# EAGLE schematic F20_NoMCU_PDM_V1 (EAGLE 9.5.2)
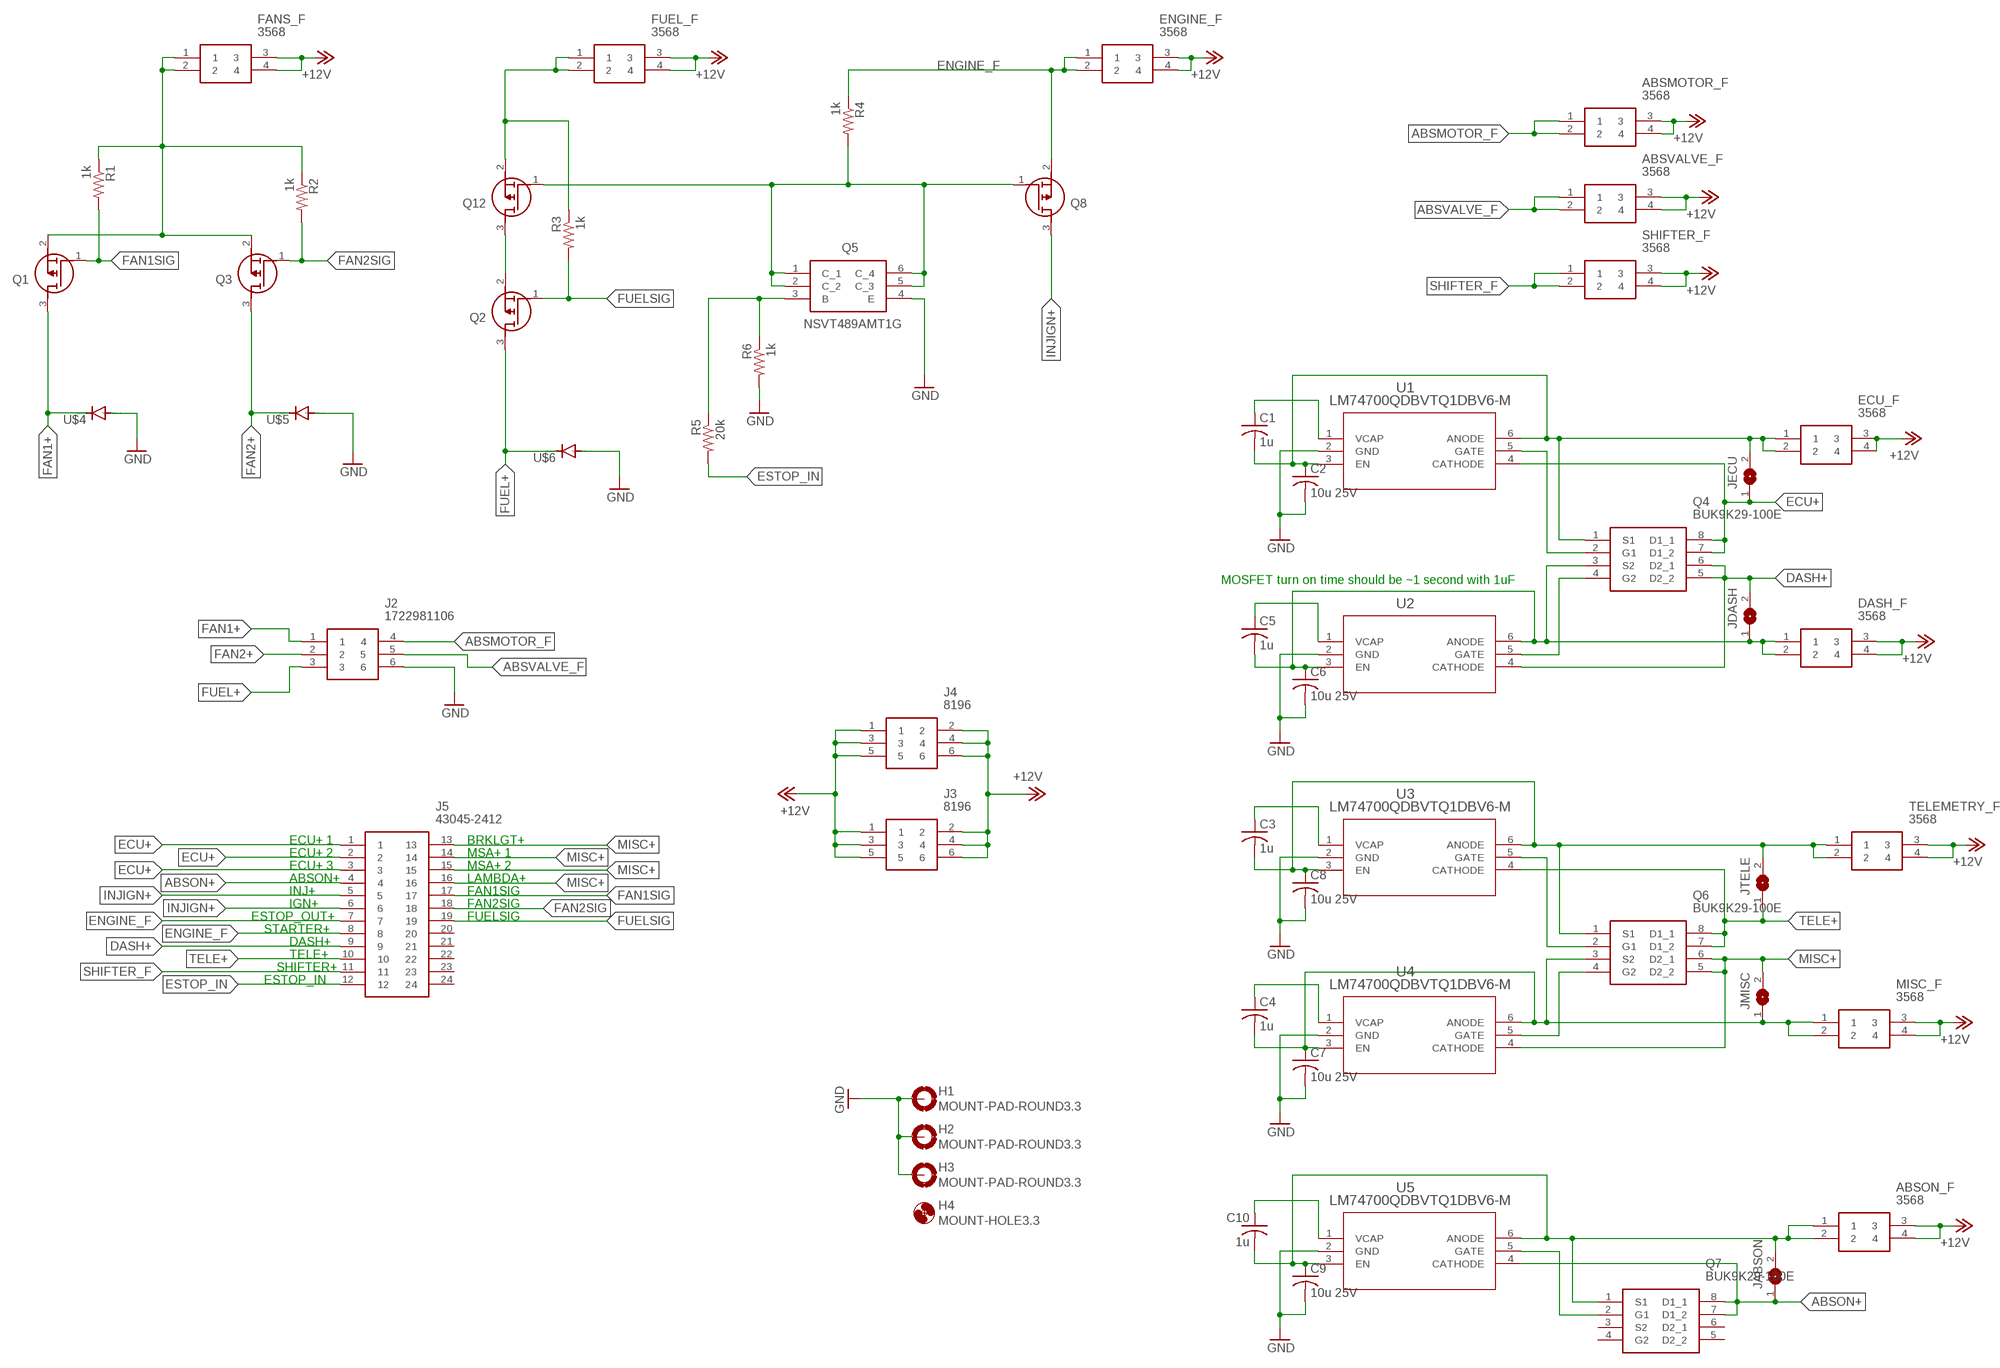
[diagram p0: schematic, sheet 1]

## Parts
ABSMOTOR_F  3568  [3568]
ABSON_F  3568  [3568]
ABSVALVE_F  3568  [3568]
C1  1u  C-USC0805  [C0805]
C2  10u 25V  C-USC0805  [C0805]
C3  1u  C-USC0805  [C0805]
C4  1u  C-USC0805  [C0805]
C5  1u  C-USC0805  [C0805]
C6  10u 25V  C-USC0805  [C0805]
C7  10u 25V  C-USC0805  [C0805]
C8  10u 25V  C-USC0805  [C0805]
C9  10u 25V  C-USC0805  [C0805]
C10  1u  C-USC0805  [C0805]
DASH_F  3568  [3568]
ECU_F  3568  [3568]
ENGINE_F  3568  [3568]
FANS_F  3568  [3568]
FUEL_F  3568  [3568]
H1  MOUNT-PAD-ROUND3.3  [3,3-PAD]
H2  MOUNT-PAD-ROUND3.3  [3,3-PAD]
H3  MOUNT-PAD-ROUND3.3  [3,3-PAD]
H4  MOUNT-HOLE3.3  [3,3]
J2  1722981106  [1722981106]
J3  8196  [8196]
J4  8196  [8196]
J5  43045-2412  [43045-2412]
JABSON  SJ  [SJ]
JDASH  SJ  [SJ]
JECU  SJ  [SJ]
JMISC  SJ  [SJ]
JTELE  SJ  [SJ]
MISC_F  3568  [3568]
Q1  IPB120P04P4L03ATMA1  [PG-TO263-3-2_1]
Q2  IPB120P04P4L03ATMA1  [PG-TO263-3-2_1]
Q3  IPB120P04P4L03ATMA1  [PG-TO263-3-2_1]
Q4  BUK9K29-100E  [SOIC127P605X105-8N]
Q5  NSVT489AMT1G  [SOT95P275X110-6N]
Q6  BUK9K29-100E  [SOIC127P605X105-8N]
Q7  BUK9K29-100E  [SOIC127P605X105-8N]
Q8  IPB120P04P4L03ATMA1  [PG-TO263-3-2_1]
Q12  IPB120P04P4L03ATMA1  [PG-TO263-3-2_1]
R1  1k  R-US_R0805  [R0805]
R2  1k  R-US_R0805  [R0805]
R3  1k  R-US_R0805  [R0805]
R4  1k  R-US_R0805  [R0805]
R5  20k  R-US_R0805  [R0805]
R6  1k  R-US_R0805  [R0805]
SHIFTER_F  3568  [3568]
TELEMETRY_F  3568  [3568]
U1  LM74700QDBVTQ1DBV6-M  [DBV6-M]
U2  LM74700QDBVTQ1DBV6-M  [DBV6-M]
U3  LM74700QDBVTQ1DBV6-M  [DBV6-M]
U4  LM74700QDBVTQ1DBV6-M  [DBV6-M]
U5  LM74700QDBVTQ1DBV6-M  [DBV6-M]
U$4  S10AL-TP  [DIOM7959X265N]
U$5  S10AL-TP  [DIOM7959X265N]
U$6  S10AL-TP  [DIOM7959X265N]

## Nets
+12V: ABSMOTOR_F.3 ABSMOTOR_F.4 ABSON_F.3 ABSON_F.4 ABSVALVE_F.3 ABSVALVE_F.4 DASH_F.3 DASH_F.4 ECU_F.3 ECU_F.4 ENGINE_F.3 ENGINE_F.4 FANS_F.3 FANS_F.4 FUEL_F.3 FUEL_F.4 J3.1 J3.2 J3.3 J3.4 J3.5 J3.6 J4.1 J4.2 J4.3 J4.4 J4.5 J4.6 MISC_F.3 MISC_F.4 SHIFTER_F.3 SHIFTER_F.4 TELEMETRY_F.3 TELEMETRY_F.4
ABSMOTOR_F: ABSMOTOR_F.1 ABSMOTOR_F.2 J2.4
ABSON+: J5.4 JABSON.1 Q7.7(D1_2) Q7.8(D1_1) U5.4(CATHODE)
ABSVALVE_F: ABSVALVE_F.1 ABSVALVE_F.2 J2.5
DASH+: J5.9 JDASH.2 Q4.5(D2_2) Q4.6(D2_1) U2.4(CATHODE)
ECU+: J5.1 J5.2 J5.3 JECU.1 Q4.7(D1_2) Q4.8(D1_1) U1.4(CATHODE)
ENGINE_F: ENGINE_F.1 ENGINE_F.2 J5.7 J5.8 Q8.2(S) R4.1
ESTOP_IN: J5.12 R5.2
FAN1+: J2.1 Q1.3(D) U$4.C
FAN1SIG: J5.17 Q1.1(G) R1.2
FAN2+: J2.2 Q3.3(D) U$5.C
FAN2SIG: J5.18 Q3.1(G) R2.2
FUEL+: J2.3 Q2.3(D) U$6.C
FUELSIG: J5.19 Q2.1(G) R3.2
GND: C2.2 C6.2 C7.2 C8.2 C9.2 H1.B3,3(MOUNT) H2.B3,3(MOUNT) H3.B3,3(MOUNT) J2.6 Q5.4(E) R6.2 U1.2(GND) U2.2(GND) U3.2(GND) U4.2(GND) U5.2(GND) U$4.A U$5.A U$6.A
INJIGN+: J5.5 J5.6 Q8.3(D)
MISC+: J5.13 J5.14 J5.15 J5.16 JMISC.2 Q6.5(D2_2) Q6.6(D2_1) U4.4(CATHODE)
N$1: FANS_F.1 FANS_F.2 Q1.2(S) Q3.2(S) R1.1 R2.1
N$2: FUEL_F.1 FUEL_F.2 Q12.2(S) R3.1
N$3: Q2.2(S) Q12.3(D)
N$4: C1.2 C2.1 ECU_F.1 ECU_F.2 JECU.2 Q4.1(S1) U1.3(EN) U1.6(ANODE)
N$5: Q5.3(B) R5.1 R6.1
N$6: C1.1 U1.1(VCAP)
N$7: Q5.1(C_1) Q5.2(C_2) Q5.5(C_3) Q5.6(C_4) Q8.1(G) Q12.1(G) R4.2
N$8: C5.1 U2.1(VCAP)
N$9: C5.2 C6.1 DASH_F.1 DASH_F.2 JDASH.1 Q4.3(S2) U2.3(EN) U2.6(ANODE)
N$11: ABSON_F.1 ABSON_F.2 C9.1 C10.2 JABSON.2 Q7.1(S1) U5.3(EN) U5.6(ANODE)
N$12: Q4.2(G1) U1.5(GATE)
N$14: C10.1 U5.1(VCAP)
N$15: Q4.4(G2) U2.5(GATE)
N$16: C3.1 U3.1(VCAP)
N$19: C4.1 U4.1(VCAP)
N$20: Q7.2(G1) U5.5(GATE)
N$22: C4.2 C7.1 JMISC.1 MISC_F.1 MISC_F.2 Q6.3(S2) U4.3(EN) U4.6(ANODE)
N$23: C3.2 C8.1 JTELE.2 Q6.1(S1) TELEMETRY_F.1 TELEMETRY_F.2 U3.3(EN) U3.6(ANODE)
N$28: Q6.2(G1) U3.5(GATE)
N$30: Q6.4(G2) U4.5(GATE)
SHIFTER_F: J5.11 SHIFTER_F.1 SHIFTER_F.2
TELE+: J5.10 JTELE.1 Q6.7(D1_2) Q6.8(D1_1) U3.4(CATHODE)
Unconnected: J5.20 J5.21 J5.22 J5.23 J5.24 Q7.3(S2) Q7.4(G2) Q7.5(D2_2) Q7.6(D2_1)

## Notes on the sheet
- MOSFET turn on time should be ~1 second with 1uF
- ECU+ 1 | BRKLGT+
- ECU+ 2 | MSA+ 1
- ECU+ 3 | MSA+ 2
- ABSON+ | LAMBDA+
- INJ+ | FAN1SIG
- IGN+ | FAN2SIG
- ESTOP_OUT+ | FUELSIG
- STARTER+
- DASH+
- TELE+
- SHIFTER+
- ESTOP_IN

## Library data of the parts
ABSMOTOR_F ABSON_F ABSVALVE_F DASH_F ECU_F ENGINE_F FANS_F FUEL_F MISC_F SHIFTER_F TELEMETRY_F = SamacSys_Parts:3568: Fuse Holder .63 MINI FUSE HOLDER Source: Datasheet <https://componentsearchengine.com/Datasheets/1/3568.pdf>; DESCRIPTION: Fuse Holder .63 MINI FUSE HOLDER; HEIGHT: 7.37mm; MANUFACTURER_NAME: Keystone Electronics; MANUFACTURER_PART_NUMBER: 3568; MOUSER_PART_NUMBER: 534-3568; MOUSER_PRICE-STOCK: https://www.mouser.com/Search/Refine.aspx?Keyword=534-3568
C1-C10 = rcl:C-US: CAPACITOR, American symbol; SPICEPREFIX: C
H1-H3 = holes:MOUNT-PAD-ROUND: MOUNTING PAD, round
H4 = holes:MOUNT-HOLE: MOUNTING HOLE with drill center marker
J2 = Molex_1722981106:1722981106: ULTRAFIT CONN HDR 06CKT Source: Datasheet <http://www.molex.com/pdm_docs/sd/1722981106_sd.pdf>; DESCRIPTION: ULTRAFIT CONN HDR 06CKT; HEIGHT: 14mm; MANUFACTURER_NAME: Molex; MANUFACTURER_PART_NUMBER: 1722981106
J3 J4 = 8196_ScrewTerminal:8196: Terminal; 10-32; Stainless Steel; 3/8 in.; 0.679 in.; 0.679 in.; Brass; Tin Source: Datasheet <https://componentsearchengine.com/Datasheets/1/8196.pdf>; DESCRIPTION: Terminal; 10-32; Stainless Steel; 3/8 in.; 0.679 in.; 0.679 in.; Brass; Tin; HEIGHT: 11.51mm; MANUFACTURER_NAME: Keystone Electronics; MANUFACTURER_PART_NUMBER: 8196; MOUSER_PART_NUMBER: 534-8196; MOUSER_PRICE-STOCK: https://www.mouser.com/Search/Refine.aspx?Keyword=534-8196
J5 = Molex_0430452412:43045-2412: Header 3.00mm, WTB, dual row, vert,24w Molex MICRO-FIT 3.0 Series, Series Number 43045, 3mm Pitch 24 Way 2 Row Shrouded Straight PCB Header, Through Hole Source: Datasheet <https://componentsearchengine.com/Datasheets/1/43045-2412.pdf>; DESCRIPTION: Header 3.00mm, WTB, dual row, vert,24w Molex MICRO-FIT 3.0 Series, Series Number 43045, 3mm Pitch 24 Way 2 Row Shrouded Straight PCB Header, Through Hole; HEIGHT: mm; MANUFACTURER_NAME: Molex; MANUFACTURER_PART_NUMBER: 43045-2412; MOUSER_PART_NUMBER: 538-43045-2412; MOUSER_PRICE-STOCK: https://www.mouser.com/Search/Refine.aspx?Keyword=538-43045-2412
JABSON JDASH JECU JMISC JTELE = jumper:SJ: SMD solder JUMPER
Q1-Q3 Q8 Q12 = IPB120P04P4L03ATMA1:IPB120P04P4L03ATMA1: IPB120P04P4L03ATMA1 P-Channel MOSFET, 120 A, 40 V OptiMOS P, 3-Pin D2PAK Infineon Source: Datasheet <https://componentsearchengine.com/Datasheets/1/IPB120P04P4L03ATMA1.pdf>; DESCRIPTION: IPB120P04P4L03ATMA1 P-Channel MOSFET, 120 A, 40 V OptiMOS P, 3-Pin D2PAK Infineon; HEIGHT: mm; MANUFACTURER_NAME: Infineon; MANUFACTURER_PART_NUMBER: IPB120P04P4L03ATMA1; MOUSER_PART_NUMBER: 726-IPB120P04P4L03AT; MOUSER_PRICE-STOCK: https://www.mouser.com/Search/Refine.aspx?Keyword=726-IPB120P04P4L03AT
Q4 Q6 Q7 = BUK9K29-100E:BUK9K29-100E: NPN/PNP high power double bipolar transistor in a SOT1205 (LFPAK56D) Surface Mounted Device (SMD) power plastic package Source: Datasheet <https://componentsearchengine.com/Datasheets/1/PHPT610030NPKX.pdf>; DESCRIPTION: NPN/PNP high power double bipolar transistor in a SOT1205 (LFPAK56D) Surface Mounted Device (SMD) power plastic package; HEIGHT: 1.05mm; MANUFACTURER_NAME: Nexperia; MANUFACTURER_PART_NUMBER: PHPT610030NPKX; MOUSER2_PART_NUMBER: 771-PHPT610030NPKX; MOUSER2_PRICE-STOCK: https://www.mouser.com/Search/Refine.aspx?Keyword=771-PHPT610030NPKX
Q5 = NSVT489AMT1G:NSVT489AMT1G: NPN Bipolar Transistor, 2 A 30 V, 6-pin TSOP Source: Datasheet <https://componentsearchengine.com/Datasheets/1/NSVT489AMT1G.pdf>; DESCRIPTION: NPN Bipolar Transistor, 2 A 30 V, 6-pin TSOP; HEIGHT: 1.1mm; MANUFACTURER_NAME: ON Semiconductor; MANUFACTURER_PART_NUMBER: NSVT489AMT1G; MOUSER_PART_NUMBER: 863-NSVT489AMT1G; MOUSER_PRICE-STOCK: https://www.mouser.com/Search/Refine.aspx?Keyword=863-NSVT489AMT1G
R1-R6 = rcl:R-US_: RESISTOR, American symbol; SPICEPREFIX: R
U1-U5 = LM74700:LM74700QDBVTQ1; COPYRIGHT: Copyright (C) 2016 Accelerated Designs. All rights reserved; MANUFACTURER_PART_NUMBER: LM74700QDBVTQ1; VENDOR: Texas Instruments
U$4-U$6 = S10AL-TP:S10AL-TP